# EAGLE design Clock_v2.1 (EAGLE 7.5.0)
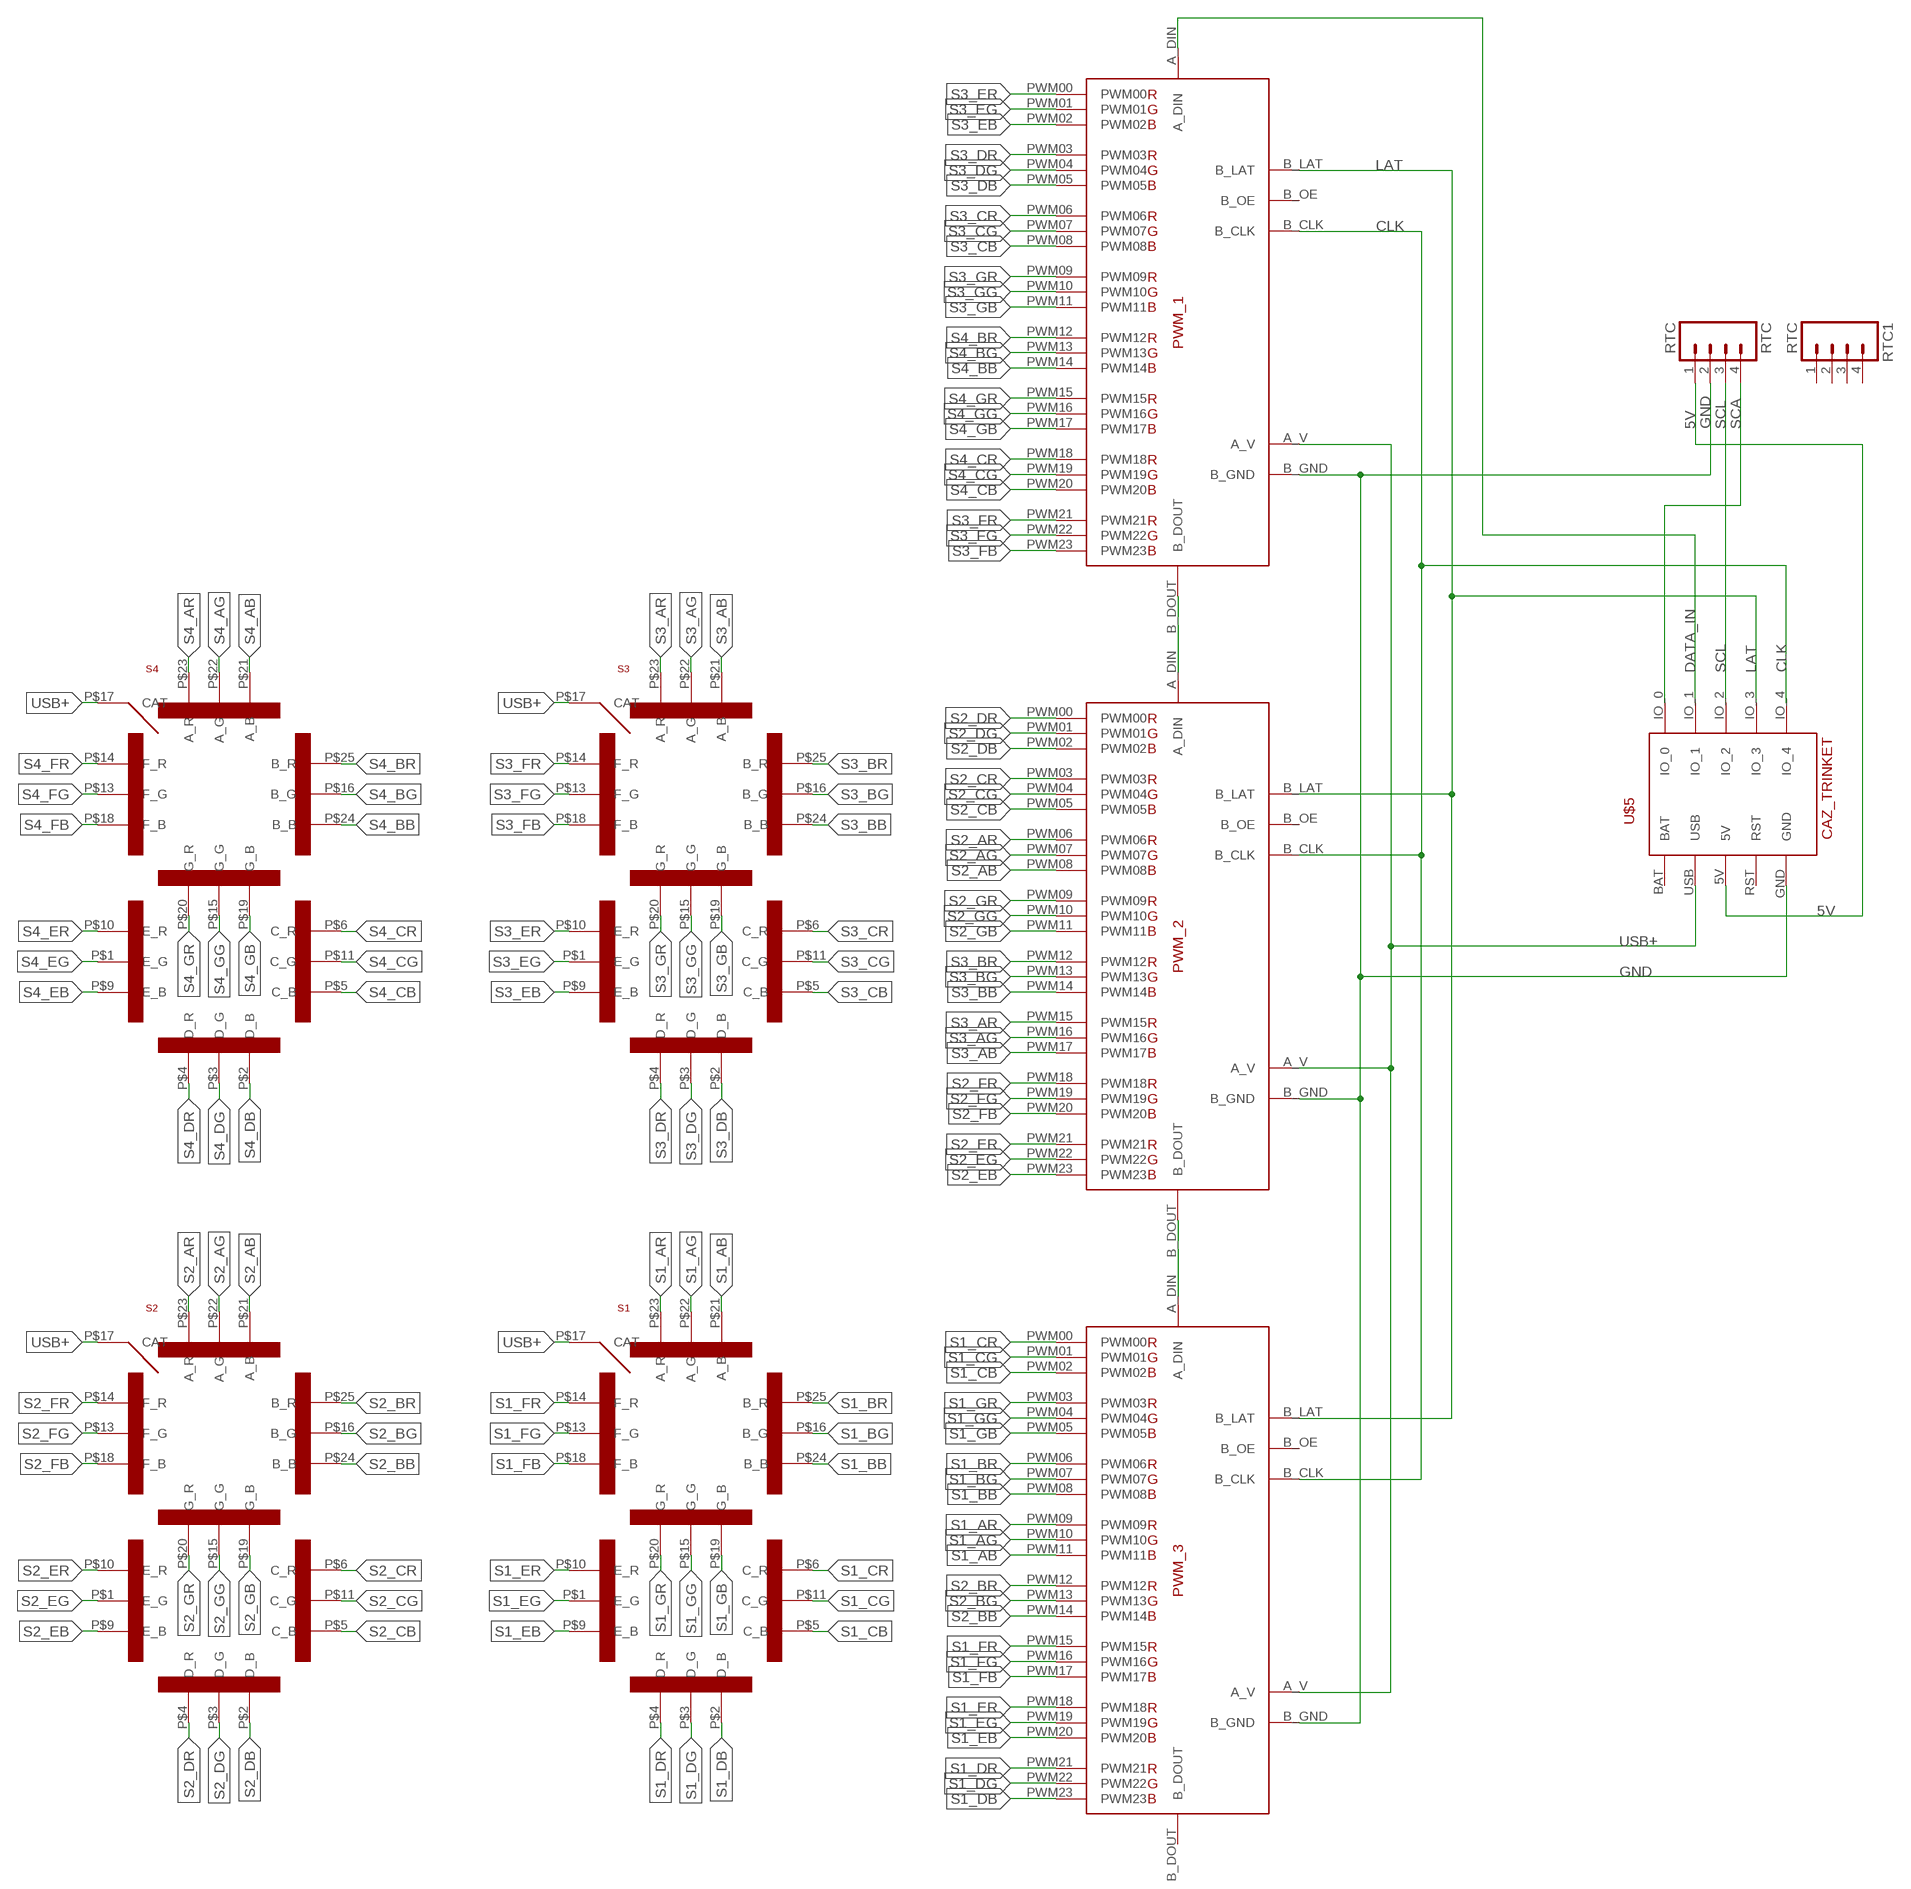
[diagram p0: schematic, sheet 1]

## Parts
PWM_1  CAZ_24PWM_DRIVER_MINIMAL  [CAZ_24PWM_DRIVER_MINIMAL]
PWM_2  CAZ_24PWM_DRIVER_MINIMAL  [CAZ_24PWM_DRIVER_MINIMAL]
PWM_3  CAZ_24PWM_DRIVER_MINIMAL  [CAZ_24PWM_DRIVER_MINIMAL]
RTC  RTC  M041X04_NO_SILK  [1X04_NO_SILK]
RTC1  RTC  M041X04_NO_SILK  [1X04_NO_SILK]
S1  CAZ_7SEGMENT_RGB_LEDBACKSIDE_MOUNT  [CAZ_7SEGMENT_RGB_LED]
S2  CAZ_7SEGMENT_RGB_LEDBACKSIDE_MOUNT  [CAZ_7SEGMENT_RGB_LED]
S3  CAZ_7SEGMENT_RGB_LEDBACKSIDE_MOUNT  [CAZ_7SEGMENT_RGB_LED]
S4  CAZ_7SEGMENT_RGB_LEDBACKSIDE_MOUNT  [CAZ_7SEGMENT_RGB_LED]
U$5  CAZ_TRINKET  [CAZ_TRINKET]

## Nets
5V: RTC.1 U$5.5V
CLK: PWM_1.B_CLK PWM_2.B_CLK PWM_3.B_CLK U$5.IO_4
DATA_IN: PWM_1.A_DIN U$5.IO_1
GND: PWM_1.B_GND PWM_2.B_GND PWM_3.B_GND RTC.2 U$5.GND
LAT: PWM_1.B_LAT PWM_2.B_LAT PWM_3.B_LAT U$5.IO_3
N$1: PWM_1.B_DOUT PWM_2.A_DIN
N$2: PWM_2.B_DOUT PWM_3.A_DIN
S1_AB: PWM_3.PWM11 S1.P$21(A_B)
S1_AG: PWM_3.PWM10 S1.P$22(A_G)
S1_AR: PWM_3.PWM09 S1.P$23(A_R)
S1_BB: PWM_3.PWM08 S1.P$24(B_B)
S1_BG: PWM_3.PWM07 S1.P$16(B_G)
S1_BR: PWM_3.PWM06 S1.P$25(B_R)
S1_CB: PWM_3.PWM02 S1.P$5(C_B)
S1_CG: PWM_3.PWM01 S1.P$11(C_G)
S1_CR: PWM_3.PWM00 S1.P$6(C_R)
S1_DB: PWM_3.PWM23 S1.P$2(D_B)
S1_DG: PWM_3.PWM22 S1.P$3(D_G)
S1_DR: PWM_3.PWM21 S1.P$4(D_R)
S1_EB: PWM_3.PWM20 S1.P$9(E_B)
S1_EG: PWM_3.PWM19 S1.P$1(E_G)
S1_ER: PWM_3.PWM18 S1.P$10(E_R)
S1_FB: PWM_3.PWM17 S1.P$18(F_B)
S1_FG: PWM_3.PWM16 S1.P$13(F_G)
S1_FR: PWM_3.PWM15 S1.P$14(F_R)
S1_GB: PWM_3.PWM05 S1.P$19(G_B)
S1_GG: PWM_3.PWM04 S1.P$15(G_G)
S1_GR: PWM_3.PWM03 S1.P$20(G_R)
S2_AB: PWM_2.PWM08 S2.P$21(A_B)
S2_AG: PWM_2.PWM07 S2.P$22(A_G)
S2_AR: PWM_2.PWM06 S2.P$23(A_R)
S2_BB: PWM_3.PWM14 S2.P$24(B_B)
S2_BG: PWM_3.PWM13 S2.P$16(B_G)
S2_BR: PWM_3.PWM12 S2.P$25(B_R)
S2_CB: PWM_2.PWM05 S2.P$5(C_B)
S2_CG: PWM_2.PWM04 S2.P$11(C_G)
S2_CR: PWM_2.PWM03 S2.P$6(C_R)
S2_DB: PWM_2.PWM02 S2.P$2(D_B)
S2_DG: PWM_2.PWM01 S2.P$3(D_G)
S2_DR: PWM_2.PWM00 S2.P$4(D_R)
S2_EB: PWM_2.PWM23 S2.P$9(E_B)
S2_EG: PWM_2.PWM22 S2.P$1(E_G)
S2_ER: PWM_2.PWM21 S2.P$10(E_R)
S2_FB: PWM_2.PWM20 S2.P$18(F_B)
S2_FG: PWM_2.PWM19 S2.P$13(F_G)
S2_FR: PWM_2.PWM18 S2.P$14(F_R)
S2_GB: PWM_2.PWM11 S2.P$19(G_B)
S2_GG: PWM_2.PWM10 S2.P$15(G_G)
S2_GR: PWM_2.PWM09 S2.P$20(G_R)
S3_AB: PWM_2.PWM17 S3.P$21(A_B)
S3_AG: PWM_2.PWM16 S3.P$22(A_G)
S3_AR: PWM_2.PWM15 S3.P$23(A_R)
S3_BB: PWM_2.PWM14 S3.P$24(B_B)
S3_BG: PWM_2.PWM13 S3.P$16(B_G)
S3_BR: PWM_2.PWM12 S3.P$25(B_R)
S3_CB: PWM_1.PWM08 S3.P$5(C_B)
S3_CG: PWM_1.PWM07 S3.P$11(C_G)
S3_CR: PWM_1.PWM06 S3.P$6(C_R)
S3_DB: PWM_1.PWM05 S3.P$2(D_B)
S3_DG: PWM_1.PWM04 S3.P$3(D_G)
S3_DR: PWM_1.PWM03 S3.P$4(D_R)
S3_EB: PWM_1.PWM02 S3.P$9(E_B)
S3_EG: PWM_1.PWM01 S3.P$1(E_G)
S3_ER: PWM_1.PWM00 S3.P$10(E_R)
S3_FB: PWM_1.PWM23 S3.P$18(F_B)
S3_FG: PWM_1.PWM22 S3.P$13(F_G)
S3_FR: PWM_1.PWM21 S3.P$14(F_R)
S3_GB: PWM_1.PWM11 S3.P$19(G_B)
S3_GG: PWM_1.PWM10 S3.P$15(G_G)
S3_GR: PWM_1.PWM09 S3.P$20(G_R)
S4_AB: S4.P$21(A_B)
S4_AG: S4.P$22(A_G)
S4_AR: S4.P$23(A_R)
S4_BB: PWM_1.PWM14 S4.P$24(B_B)
S4_BG: PWM_1.PWM13 S4.P$16(B_G)
S4_BR: PWM_1.PWM12 S4.P$25(B_R)
S4_CB: PWM_1.PWM20 S4.P$5(C_B)
S4_CG: PWM_1.PWM19 S4.P$11(C_G)
S4_CR: PWM_1.PWM18 S4.P$6(C_R)
S4_DB: S4.P$2(D_B)
S4_DG: S4.P$3(D_G)
S4_DR: S4.P$4(D_R)
S4_EB: S4.P$9(E_B)
S4_EG: S4.P$1(E_G)
S4_ER: S4.P$10(E_R)
S4_FB: S4.P$18(F_B)
S4_FG: S4.P$13(F_G)
S4_FR: S4.P$14(F_R)
S4_GB: PWM_1.PWM17 S4.P$19(G_B)
S4_GG: PWM_1.PWM16 S4.P$15(G_G)
S4_GR: PWM_1.PWM15 S4.P$20(G_R)
SCA: RTC.4 U$5.IO_0
SCL: RTC.3 U$5.IO_2
USB+: PWM_1.A_V PWM_2.A_V PWM_3.A_V S1.P$17(CAT) S2.P$17(CAT) S3.P$17(CAT) S4.P$17(CAT) U$5.USB
Unconnected: PWM_1.B_OE PWM_2.B_OE PWM_3.B_DOUT PWM_3.B_OE RTC1.1 RTC1.2 RTC1.3 RTC1.4 U$5.BAT U$5.RST

## Library data of the parts
PWM_1-PWM_3 = caz_lib:CAZ_24PWM_DRIVER_MINIMAL
RTC RTC1 = SparkFun-Connectors:M04: Header 4 Standard 4-pin 0.1" header. Use with straight break away headers (SKU : PRT-00116), right angle break away headers (PRT-00553), swiss pins (PRT-00743), machine pins (PRT-00117), and female headers (PRT-00115). Molex polarized connector foot print use with SKU : PRT-08231 with associated crimp pins and housings. 1MM SMD Version SKU: PRT-10208
S1-S4 = caz_lib:CAZ_7SEGMENT_RGB_LED: adafruit: RGB 7-Segment Digit ID: 1399 <http://www.adafruit.com/products/1399> $14.95 Datasheet <http://www.adafruit.com/datasheets/AD-121F2_cat_e.pdf> Spec: 1" Tall Digit; CREATED_BY: caz; SOLD_BY: adafruit
U$5 = caz_lib:CAZ_TRINKET

## Net classes
0 default: width 0.254 mm, drill 0.508 mm, clearance 0.254 mm
1 PWR: width 0.381 mm, drill 0.508 mm, clearance 0.254 mm

## Board
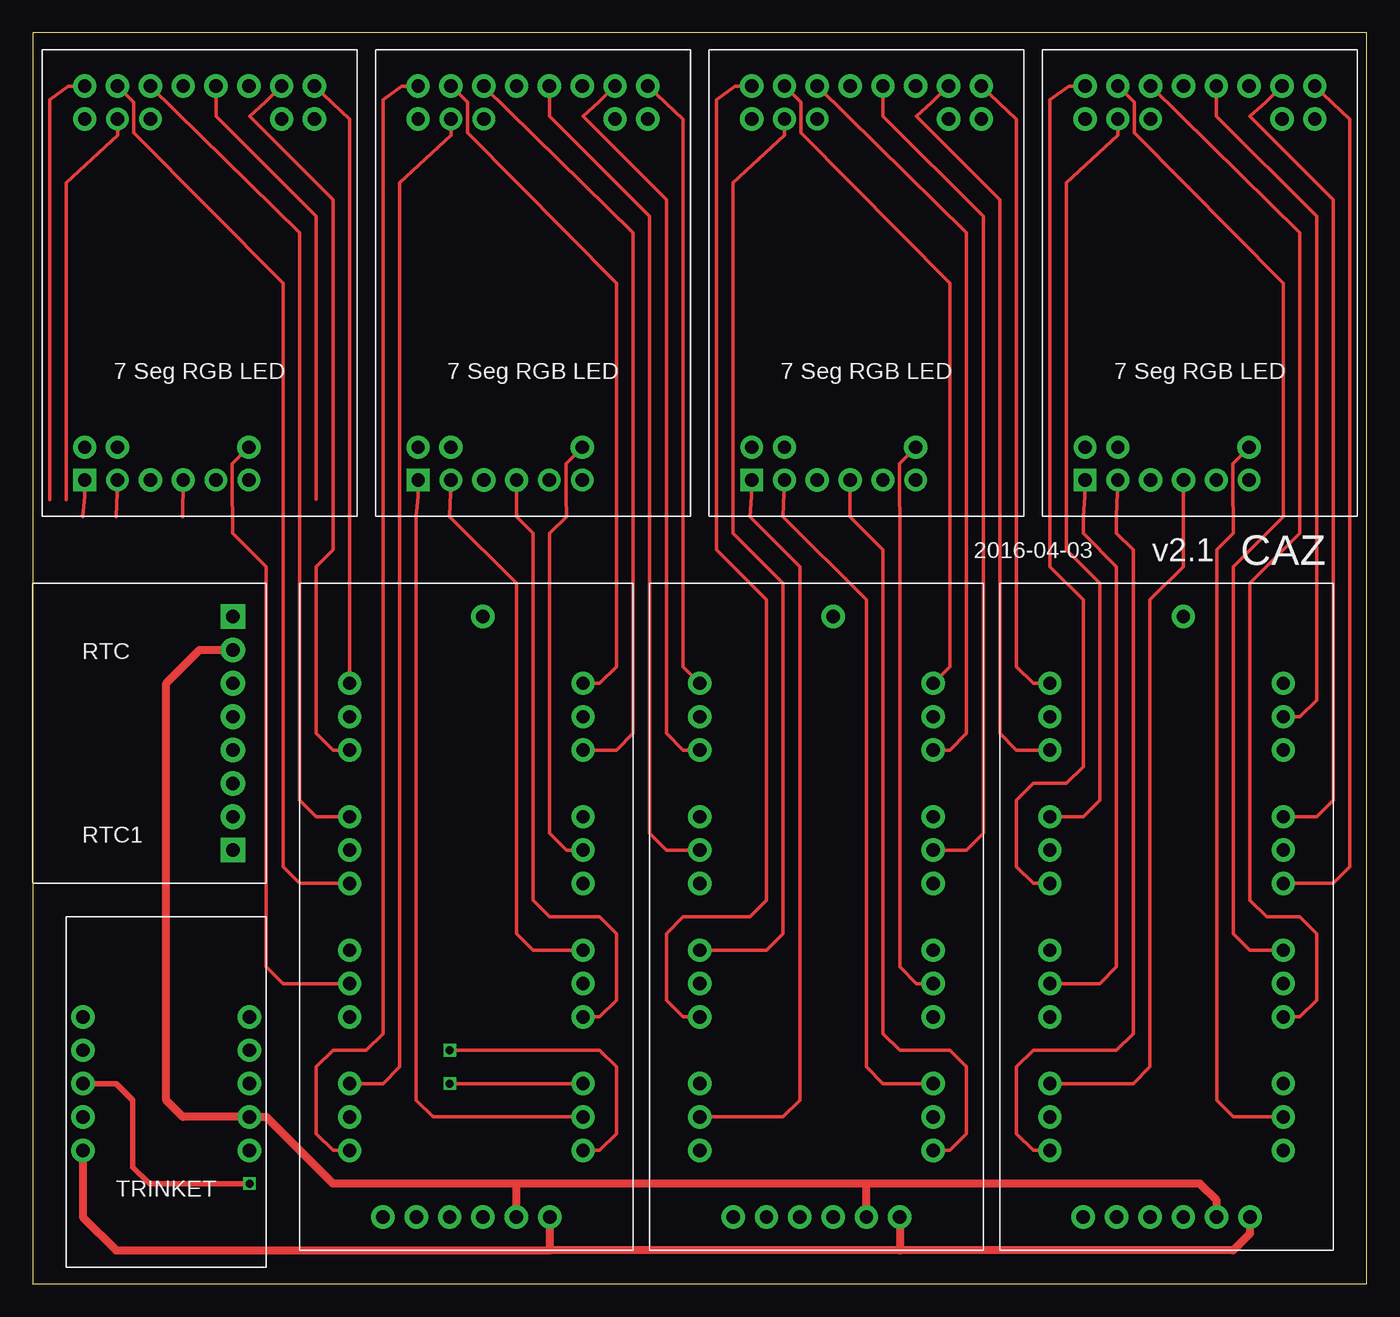
[diagram p1: board, top side]
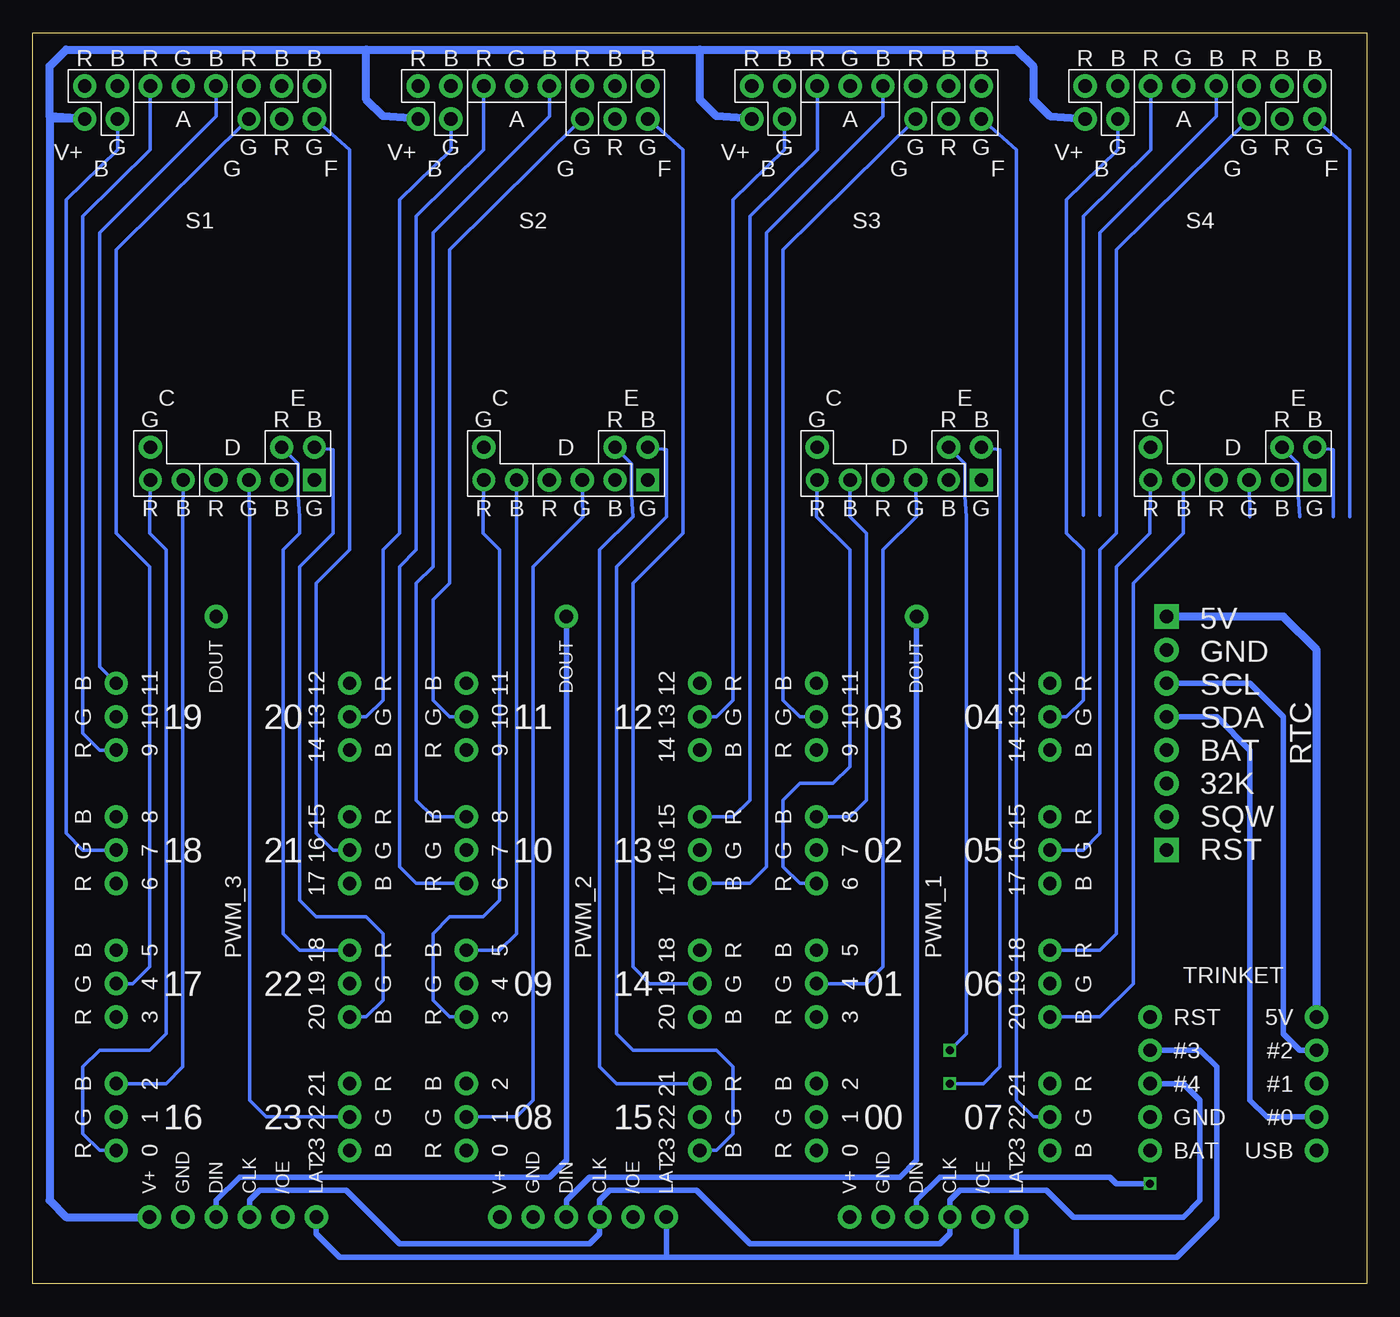
[diagram p2: board, bottom side, seen from below]

Size 101.6 x 95.25 mm. Coordinates in mm from the lower left corner, seen from the top.
Outline: 0,0 101.6,0 101.6,95.25 0,95.25 0,0
Copper layers (1*16): Top 0.0356mm / dielectric 1.5011mm / Bottom 0.0356mm
Design rules "OSH_Park": minimum track width 6mil, minimum drill 13mil, track to track 6mil, track to pad 6mil, pad to pad 6mil, via to via 6mil, smd to smd 6mil, copper to edge 15mil, drill to drill 6mil, minimum pad ring 7mil, minimum via ring 7mil, stop-mask expansion 3mil, vias tented up to drill 0mil, thermal gap 10mil

### Footprints (pad centres in the part's own frame; a part is rotated, then mirrored left to right if it is on the bottom)
CAZ_24PWM_DRIVER_MINIMAL = drill 1.016 pad 1.778: A_DIN -22.86,-1.27; A_V -22.86,-6.35; B_CLK -22.86,1.27; B_DOUT 22.86,-1.27; B_GND -22.86,-3.81; B_LAT -22.86,6.35; B_OE -22.86,3.81; PWM00 -17.78,-8.89; PWM01 -15.24,-8.89; PWM02 -12.7,-8.89; PWM03 -7.62,-8.89; PWM04 -5.08,-8.89; PWM05 -2.54,-8.89; PWM06 2.54,-8.89; PWM07 5.08,-8.89; PWM08 7.62,-8.89; PWM09 12.7,-8.89; PWM10 15.24,-8.89; PWM11 17.78,-8.89; PWM12 17.78,8.89; PWM13 15.24,8.89; PWM14 12.7,8.89; PWM15 7.62,8.89; PWM16 5.08,8.89; PWM17 2.54,8.89; PWM18 -2.54,8.89; PWM19 -5.08,8.89; PWM20 -7.62,8.89; PWM21 -12.7,8.89; PWM22 -15.24,8.89; PWM23 -17.78,8.89
1X04_NO_SILK = drill 1.016 pad 1.88 square: 1 0,0 | drill 1.016 pad 1.88: 2 2.54,0; 3 5.08,0; 4 7.62,0
CAZ_7SEGMENT_RGB_LED = drill 1.016 pad 1.727 square: P$1 -8.75,-15 | drill 1.016 pad 1.727: P$2 -6.25,-15; P$5 1.25,-15; P$6 3.75,-15; P$9 -8.75,-12.5; P$14 -6.25,12.5; P$15 -3.75,12.5 | drill 1.016 pad 1.778: P$3 -3.75,-15; P$4 -1.25,-15; P$10 -6.25,-12.5; P$11 3.75,-12.5; P$13 -8.75,12.5; P$16 6.25,12.5; P$17 8.75,12.5; P$18 -8.75,15; P$19 -6.25,15; P$20 -3.75,15; P$21 -1.25,15; P$22 1.25,15; P$23 3.75,15; P$24 6.25,15; P$25 8.75,15
CAZ_TRINKET = drill 1.016 pad 1.778: 5V -6.35,5.08; BAT 6.35,-5.08; GND 6.35,-2.54; IO_0 -6.35,-2.54; IO_1 -6.35,0; IO_2 -6.35,2.54; IO_3 6.35,2.54; IO_4 6.35,0; RST 6.35,5.08; USB -6.35,-5.08

### Placement (x,y rotation side)
PWM_1  33.02,27.94 90 top
PWM_2  59.69,27.94 90 top
PWM_3  86.36,27.94 90 top
RTC  15.24,50.8 270 top
RTC1  15.24,33.02 90 top
S1  88.9,76.2 0 top
S2  63.5,76.2 0 top
S3  38.1,76.2 0 top
S4  12.7,76.2 0 top
U$5  10.16,15.24 0 top

### Tracks (layer width: path | path; a pad name or v marks a point on that pad's centre or on a via)
5V
  Bottom 0.61: U$5.5V 3.81,48.26 6.35,50.8 RTC.1
CLK
  Bottom 0.406: PWM_3.B_CLK 85.09,6.35 84.33,7.11 77.72,7.11 73.66,3.05 59.18,3.05 58.42,3.81 PWM_2.B_CLK 58.42,6.35 57.66,7.11 51.05,7.11 46.99,3.05 32.51,3.05 31.75,3.81 PWM_1.B_CLK 31.75,6.35 30.99,7.11 24.38,7.11 22.35,5.08 13.97,5.08 12.7,6.35 12.7,13.97 13.97,15.24 U$5.IO_4
DATA_IN  (via drill 0.6)
  Top 0.406: v16.51,7.62 8.89,7.62 7.62,8.89 7.62,13.97 6.35,15.24 U$5.IO_1
  Bottom 0.406: PWM_1.A_DIN 34.29,6.35 32.51,8.13 19.56,8.13 19.05,7.62 v16.51,7.62
GND
  Top 0.61: PWM_3.B_GND 90.17,6.35 88.9,7.62 63.5,7.62 | 63.5,7.62 36.83,7.62 | PWM_2.B_GND 63.5,7.62 | PWM_1.B_GND 36.83,7.62 | 36.83,7.62 22.86,7.62 17.78,12.7 U$5.GND 11.43,12.7 10.16,13.97 10.16,45.72 12.7,48.26 RTC.2
LAT
  Bottom 0.406: 53.34,2.03 26.67,2.03 | PWM_1.B_LAT 26.67,2.03 | PWM_2.B_LAT 53.34,2.03 | PWM_3.B_LAT 80.01,3.81 78.23,2.03 53.34,2.03 | U$5.IO_3 12.7,17.78 11.43,16.51 11.43,5.08 14.48,2.03 26.67,2.03
N$1
  Bottom 0.406: PWM_2.A_DIN 60.96,6.35 59.18,8.13 35.56,8.13 34.29,9.4 PWM_1.B_DOUT
N$2
  Bottom 0.406: PWM_3.A_DIN 87.63,6.35 85.85,8.13 62.23,8.13 60.96,9.4 PWM_2.B_DOUT
S1_AB
  Bottom 0.254: 96.52,58.5 96.52,46.99 PWM_3.PWM11
S1_AG
  Top 0.254: 97.79,59.73 97.79,44.45 96.52,43.18 PWM_3.PWM10
S1_AR
  Bottom 0.254: 97.79,58.5 97.79,41.91 96.52,40.64 PWM_3.PWM09
S1_BB
  Top 0.254: PWM_3.PWM08 97.79,35.56 99.06,36.83 99.06,59.73
S1_BG
  Bottom 0.254: PWM_3.PWM07 97.79,33.02 99.06,34.29 99.06,58.5
S1_BR
  Top 0.254: PWM_3.PWM06 99.06,30.48 100.33,31.75 100.33,59.73
S1_CB
  Bottom 0.254: PWM_3.PWM02 91.44,15.24 90.17,16.51 90.17,58.42
S1_CG
  Top 0.254: PWM_3.PWM01 91.44,12.7 90.17,13.97 90.17,55.88 91.44,57.15 91.44,58.42
S1_CR
  Bottom 0.254: PWM_3.PWM00 96.52,10.16 97.79,11.43 97.79,16.51 96.52,17.78 92.71,17.78 91.44,19.05 91.44,55.88 92.71,57.15 92.71,58.42
S1_DB
  Top 0.254: PWM_3.PWM23 76.2,10.16 74.93,11.43 74.93,16.51 76.2,17.78 82.55,17.78 83.82,19.05 83.82,55.88 82.55,57.15 82.55,58.42
S1_DG
  Bottom 0.254: PWM_3.PWM22 83.82,12.7 85.09,13.97 85.09,58.42
S1_DR
  Top 0.254: 87.63,58.42 87.63,54.61 85.09,52.07 85.09,16.51 83.82,15.24 PWM_3.PWM21
S1_EB
  Bottom 0.254: PWM_3.PWM20 76.2,20.32 74.93,21.59 74.93,26.67 76.2,27.94 80.01,27.94 81.28,29.21 81.28,54.61 78.74,57.15 78.74,58.42
S1_EG
  Top 0.254: PWM_3.PWM19 81.28,22.86 82.55,24.13 82.55,54.61 80.01,57.15 80.01,58.42
S1_ER
  Bottom 0.254: PWM_3.PWM18 81.28,25.4 82.55,26.67 82.55,55.88 81.28,57.15 81.28,58.42
S1_FB
  Top 0.254: PWM_3.PWM17 76.2,30.48 74.93,31.75 74.93,36.83 76.2,38.1 78.74,38.1 80.01,39.37 80.01,52.07 77.47,54.61 77.47,59.69
S1_FG
  Bottom 0.254: PWM_3.PWM16 78.74,33.02 80.01,34.29 80.01,53.34 77.47,55.88 77.47,58.42
S1_FR
  Top 0.254: 78.74,59.69 78.74,55.88 81.28,53.34 81.28,36.83 80.01,35.56 PWM_3.PWM15
S1_GB
  Top 0.254: PWM_3.PWM05 92.71,25.4 91.44,26.67 91.44,54.61 95.25,58.42 95.25,59.73
S1_GG
  Bottom 0.254: 95.25,58.5 95.25,57.15 92.71,54.61 92.71,24.13 93.98,22.86 PWM_3.PWM04
S1_GR
  Top 0.254: PWM_3.PWM03 96.52,20.32 97.79,21.59 97.79,26.67 96.52,27.94 93.98,27.94 92.71,29.21 92.71,53.34 96.52,57.15 96.52,59.73
S2_AB
  Bottom 0.254: 71.12,58.5 71.12,54.61 72.39,53.34 72.39,36.83 71.12,35.56 PWM_2.PWM08
S2_AG
  Top 0.254: 72.39,59.73 72.39,34.29 71.12,33.02 PWM_2.PWM07
S2_AR
  Bottom 0.254: 72.39,58.5 72.39,55.88 73.66,54.61 73.66,31.75 72.39,30.48 PWM_2.PWM06
S2_BB
  Top 0.254: 73.66,59.73 73.66,41.91 74.93,40.64 PWM_3.PWM14
S2_BG
  Bottom 0.254: PWM_3.PWM13 76.2,43.18 74.93,44.45 74.93,55.88 73.66,57.15 73.66,58.5
S2_BR
  Top 0.254: 74.93,59.73 74.93,46.99 76.2,45.72 PWM_3.PWM12
S2_CB
  Bottom 0.254: 64.77,58.42 64.77,26.67 66.04,25.4 PWM_2.PWM05
S2_CG
  Top 0.254: PWM_2.PWM04 67.31,22.86 66.04,24.13 66.04,58.42
S2_CR
  Bottom 0.254: PWM_2.PWM03 69.85,20.32 71.12,21.59 71.12,26.67 69.85,27.94 67.31,27.94 66.04,29.21 66.04,55.88 67.31,57.15 67.31,58.42
S2_DB
  Top 0.254: 57.15,58.42 63.5,52.07 63.5,16.51 64.77,15.24 PWM_2.PWM02
S2_DG
  Bottom 0.254: 59.69,58.42 63.5,54.61 63.5,13.97 64.77,12.7 PWM_2.PWM01
S2_DR
  Top 0.254: PWM_2.PWM00 69.85,10.16 71.12,11.43 71.12,16.51 69.85,17.78 66.04,17.78 64.77,19.05 64.77,20.32 64.77,21.59 64.77,55.88 62.23,58.42
S2_EB
  Bottom 0.254: PWM_2.PWM23 49.53,10.16 48.26,11.43 48.26,16.51 49.53,17.78 55.88,17.78 57.15,19.05 57.15,54.61 53.34,58.42
S2_EG
  Top 0.254: 54.61,58.42 58.42,54.61 58.42,13.97 57.15,12.7 PWM_2.PWM22
S2_ER
  Bottom 0.254: 55.88,58.42 58.42,55.88 58.42,16.51 57.15,15.24 PWM_2.PWM21
S2_FB
  Top 0.254: PWM_2.PWM20 49.53,20.32 48.26,21.59 48.26,26.67 49.53,27.94 54.61,27.94 55.88,29.21 55.88,52.07 52.07,55.88 52.07,59.69
S2_FG
  Bottom 0.254: 52.07,58.42 52.07,57.15 55.88,53.34 55.88,24.13 54.61,22.86 PWM_2.PWM19
S2_FR
  Top 0.254: 53.34,59.69 53.34,57.15 57.15,53.34 57.15,26.67 55.88,25.4 PWM_2.PWM18
S2_GB
  Top 0.254: PWM_2.PWM11 69.85,46.99 69.85,59.73
S2_GG
  Bottom 0.254: PWM_2.PWM10 69.85,43.18 71.12,44.45 71.12,52.07 69.85,53.34 69.85,58.5
S2_GR
  Top 0.254: PWM_2.PWM09 69.85,40.64 71.12,41.91 71.12,59.73
S3_AB
  Bottom 0.254: PWM_2.PWM17 46.99,30.48 45.72,31.75 45.72,58.5
S3_AG
  Top 0.254: PWM_2.PWM16 48.26,33.02 46.99,34.29 46.99,59.73
S3_AR
  Bottom 0.254: PWM_2.PWM15 48.26,35.56 46.99,36.83 46.99,58.5
S3_BB
  Top 0.254: PWM_2.PWM14 49.53,40.64 48.26,41.91 48.26,59.73
S3_BG
  Bottom 0.254: PWM_2.PWM13 49.53,43.18 48.26,44.45 48.26,58.5 48.26,59.69
S3_BR
  Top 0.254: PWM_2.PWM12 49.53,46.99 49.53,59.73
S3_CB
  Bottom 0.254: PWM_1.PWM08 39.37,35.56 38.1,36.83 38.1,57.15 39.37,58.42
S3_CG
  Top 0.254: PWM_1.PWM07 40.64,33.02 39.37,34.29 39.37,57.15 40.64,58.42
S3_CR
  Bottom 0.254: PWM_1.PWM06 43.18,30.48 44.45,31.75 44.45,36.83 43.18,38.1 40.64,38.1 39.37,39.37 39.37,50.8 39.37,52.07 39.37,55.88 41.91,58.42
S3_DB
  Top 0.254: PWM_1.PWM05 38.1,25.4 36.83,26.67 36.83,53.34 31.75,58.42
S3_DG
  Bottom 0.254: PWM_1.PWM04 38.1,22.86 36.83,24.13 36.83,55.88 34.29,58.42
S3_DR
  Top 0.254: PWM_1.PWM03 43.18,20.32 44.45,21.59 44.45,26.67 43.18,27.94 39.37,27.94 38.1,29.21 38.1,57.15 36.83,58.42
S3_EB  (via drill 0.6)
  Top 0.254: PWM_1.PWM02 v31.75,15.24
  Bottom 0.254: v31.75,15.24 29.21,15.24 27.94,16.51 27.94,58.42
S3_EG
  Top 0.254: PWM_1.PWM01 30.48,12.7 29.21,13.97 29.21,58.42
S3_ER  (via drill 0.6)
  Top 0.254: PWM_1.PWM00 43.18,10.16 44.45,11.43 44.45,16.51 43.18,17.78 v31.75,17.78
  Bottom 0.254: v31.75,17.78 30.48,19.05 30.48,58.42
S3_FB
  Top 0.254: PWM_1.PWM23 22.86,10.16 21.59,11.43 21.59,16.51 22.86,17.78 25.4,17.78 26.67,19.05 26.67,59.69
S3_FG
  Bottom 0.254: PWM_1.PWM22 25.4,12.7 26.67,13.97 26.67,58.42
S3_FR
  Top 0.254: 27.94,59.69 27.94,19.05 27.94,17.78 27.94,16.51 26.67,15.24 PWM_1.PWM21
S3_GB
  Top 0.254: PWM_1.PWM11 43.18,45.72 44.45,46.99 44.45,59.73
S3_GG
  Bottom 0.254: PWM_1.PWM10 43.18,43.18 44.45,44.45 44.45,58.5
S3_GR
  Top 0.254: PWM_1.PWM09 44.45,40.64 45.72,41.91 45.72,59.73
S4_BB
  Top 0.254: PWM_1.PWM14 22.86,40.64 21.59,41.91 21.59,54.61 22.86,55.88 22.86,59.73
S4_BG
  Bottom 0.254: PWM_1.PWM13 22.86,43.18 21.59,44.45 21.59,55.88 22.86,57.15 22.86,58.5
S4_BR
  Top 0.254: PWM_1.PWM12 24.13,59.73
S4_CB
  Bottom 0.254: 13.97,58.42 13.97,57.15 17.78,53.34 17.78,22.86 20.32,20.32 PWM_1.PWM20
S4_CG
  Top 0.254: 15.24,58.42 15.24,57.15 17.78,54.61 17.78,24.13 19.05,22.86 PWM_1.PWM19
S4_CR
  Bottom 0.254: 16.51,58.42 16.51,57.15 19.05,54.61 19.05,26.67 20.32,25.4 PWM_1.PWM18
S4_GB
  Top 0.254: 19.05,59.73 19.05,31.75 20.32,30.48 PWM_1.PWM17
S4_GG
  Bottom 0.254: 19.05,58.5 19.05,57.15 20.32,55.88 20.32,34.29 21.59,33.02 PWM_1.PWM16
S4_GR
  Top 0.254: 20.32,59.73 20.32,36.83 21.59,35.56 PWM_1.PWM15
SCA
  Bottom 0.406: RTC.4 11.43,43.18 8.89,40.64 8.89,13.97 7.62,12.7 U$5.IO_0
SCL
  Bottom 0.406: RTC.3 8.89,45.72 6.35,43.18 6.35,19.05 5.08,17.78 U$5.IO_2
USB+
  Top 0.61: PWM_3.A_V 92.71,3.81 91.44,2.54 66.04,2.54 | 66.04,2.54 39.37,2.54 | PWM_2.A_V 66.04,2.54 | PWM_1.A_V 39.37,2.54 | U$5.USB 3.81,5.08 6.35,2.54 39.37,2.54
  Bottom 0.61: 100.33,88.9 S1.P$17 100.13,88.7 100.33,88.9 | 100.33,88.9 100.33,6.35 99.06,5.08 PWM_3.A_V | 100.33,88.9 100.33,92.71 99.06,93.98 76.2,93.98 | 76.2,93.98 50.8,93.98 | 50.8,93.98 26.67,93.98 25.4,92.71 25.4,90.17 24.13,88.9 S4.P$17 | S3.P$17 49.53,88.9 50.8,90.17 50.8,93.98 | S2.P$17 74.93,88.9 76.2,90.17 76.2,93.98

### Text on the board
tPlace: 2016-04-03 | v2.1 | CAZ
bPlace: 04 | 03 | 12 | 11 | 20 | 19 | RTC | 5V / GND / SCL / SDA / BAT / 32K / SQW / RST | 05 | 02 | 13 | 10 | 21 | 18 | 06 | 01 | 14 | 09 | 22 | 17 | 07 | 00 | 15 | 08 | 23 | 16